# EAGLE design usbmidi (EAGLE 9.6.1)

## Sheet 1 of 2
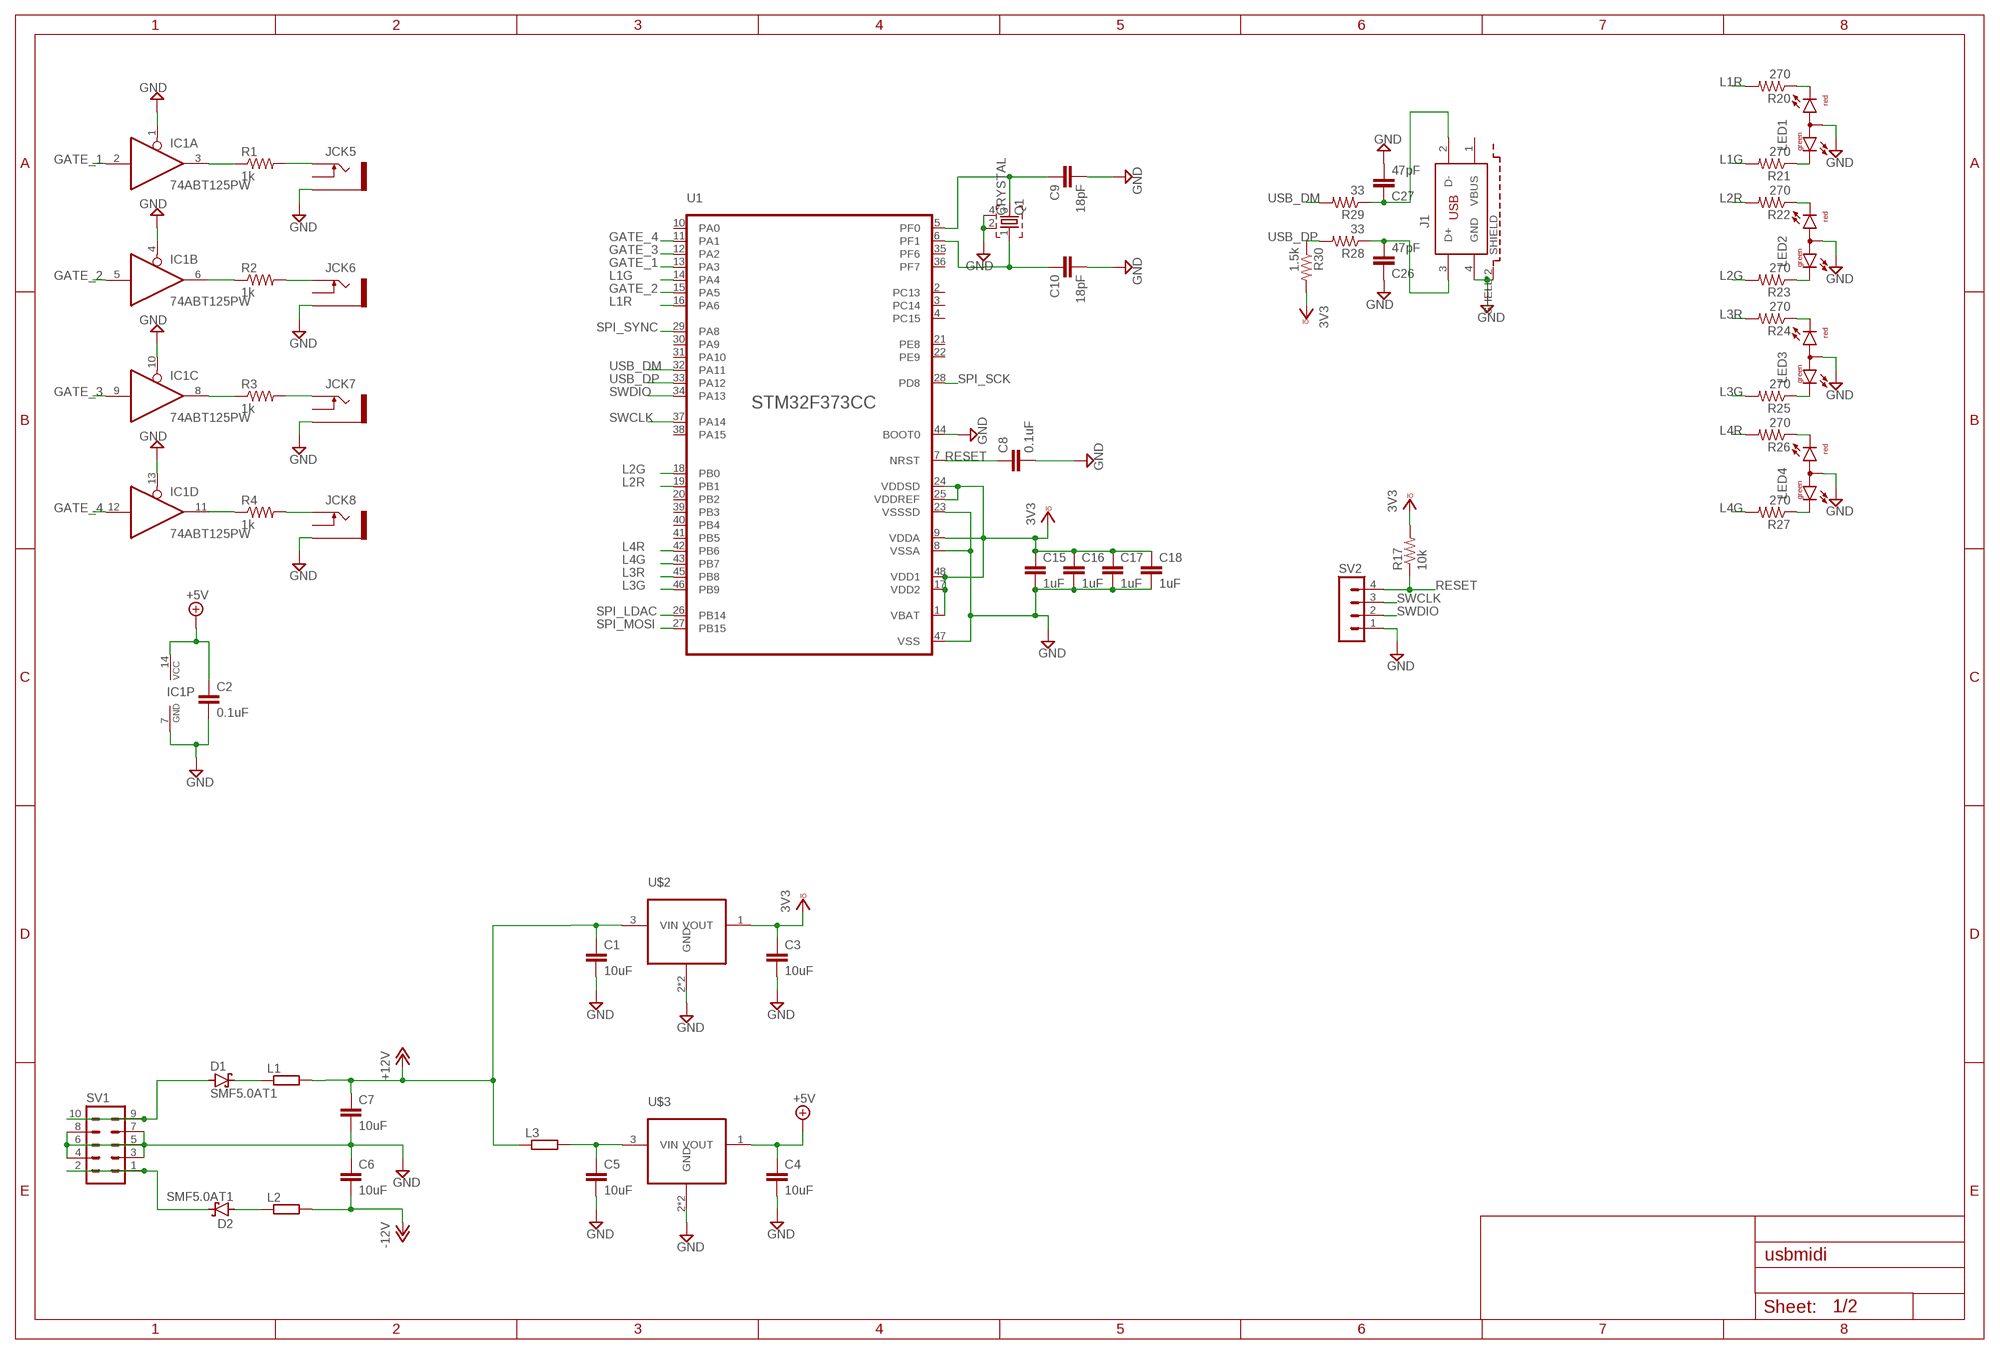
[diagram p0: schematic, sheet 1]

### Parts
C1  10uF  C-EUC0805  [C0805]
C2  0.1uF  C-EUC0603K  [C0603K]
C3  10uF  C-EUC0805  [C0805]
C4  10uF  C-EUC0805  [C0805]
C5  10uF  C-EUC0805  [C0805]
C6  10uF  C-EUC0805  [C0805]
C7  10uF  C-EUC0805  [C0805]
C8  0.1uF  C-EUC0603K  [C0603K]
C9  18pF  C-EUC0603K  [C0603K]
C10  18pF  C-EUC0603K  [C0603K]
C15  1uF  C-EUC0603K  [C0603K]
C16  1uF  C-EUC0603K  [C0603K]
C17  1uF  C-EUC0603K  [C0603K]
C18  1uF  C-EUC0603K  [C0603K]
C26  47pF  C-EUC0603K  [C0603K]
C27  47pF  C-EUC0603K  [C0603K]
D1  SMF5.0AT1  [SOD123FL]
D2  SMF5.0AT1  [SOD123FL]
IC1  74ABT125PW  [TSSOP14]
J1  61400413321  [61400413321]
JCK5  THONKICONNNEW  [WQP-PJ301M-12_JACK]
JCK6  THONKICONNNEW  [WQP-PJ301M-12_JACK]
JCK7  THONKICONNNEW  [WQP-PJ301M-12_JACK]
JCK8  THONKICONNNEW  [WQP-PJ301M-12_JACK]
L1  R-EU_R0603  [R0603]
L2  R-EU_R0603  [R0603]
L3  R-EU_R0603  [R0603]
LED1  L-115WEGW-CA  [DUOLED-A-3MM]
LED2  L-115WEGW-CA  [DUOLED-A-3MM]
LED3  L-115WEGW-CA  [DUOLED-A-3MM]
LED4  L-115WEGW-CA  [DUOLED-A-3MM]
Q1  CRYSTAL  [CTS406]
R1  1k  R-US_R0603  [R0603]
R2  1k  R-US_R0603  [R0603]
R3  1k  R-US_R0603  [R0603]
R4  1k  R-US_R0603  [R0603]
R17  10k  R-US_R0603  [R0603]
R20  270  R-US_R0603  [R0603]
R21  270  R-US_R0603  [R0603]
R22  270  R-US_R0603  [R0603]
R23  270  R-US_R0603  [R0603]
R24  270  R-US_R0603  [R0603]
R25  270  R-US_R0603  [R0603]
R26  270  R-US_R0603  [R0603]
R27  270  R-US_R0603  [R0603]
R28  33  R-US_R0603  [R0603]
R29  33  R-US_R0603  [R0603]
R30  1.5k  R-US_R0603  [R0603]
SV1  MA05-2  [MA05-2]
SV2  MA04-1  [MA04-1]
U1  STM32F373LQFP48  [LQFP48]
U$2  LD2981ABUSOT89  [SOT89]
U$3  LD2981ABUSOT89  [SOT89]

### Nets
+5V: C2.1 C4.1 IC1.14(P:VCC) U$3.1(VOUT) ; also sheet 2
+12V: C1.1 C7.1 L1.2 L3.1 U$2.3(VIN) ; also sheet 2
-12V: C6.2 L2.2 ; also sheet 2
GATE_1: IC1.2(A:I) U1.13(PA3)
GATE_2: IC1.5(B:I) U1.15(PA5)
GATE_3: IC1.9(C:I) U1.12(PA2)
GATE_4: IC1.12(D:I) U1.11(PA1)
GND: C1.2 C2.2 C3.2 C4.2 C5.2 C6.1 C7.2 C8.2 C9.2 C10.2 C15.2 C16.2 C17.2 C18.2 C26.1 C27.2 IC1.1(A:OE) IC1.4(B:OE) IC1.7(P:GND) IC1.10(C:OE) IC1.13(D:OE) J1.4(GND) J1.SHELL1(SHIELD) J1.SHELL(SHIELD) JCK5.P$3_SLEEVE(SLEEVE) JCK6.P$3_SLEEVE(SLEEVE) JCK7.P$3_SLEEVE(SLEEVE) JCK8.P$3_SLEEVE(SLEEVE) LED1.2(A) LED2.2(A) LED3.2(A) LED4.2(A) Q1.2 Q1.4 SV1.3 SV1.4 SV1.5 SV1.6 SV1.7 SV1.8 SV2.1 U1.8(VSSA) U1.23(VSSSD) U1.44(BOOT0) U1.47(VSS) U$2.2(GND) U$2.2@1(GND) U$3.2(GND) U$3.2@1(GND) ; also sheet 2
L1G: R21.2 U1.14(PA4)
L1R: R20.2 U1.16(PA6)
L2G: R23.2 U1.18(PB0)
L2R: R22.2 U1.19(PB1)
L3G: R25.2 U1.46(PB9)
L3R: R24.2 U1.45(PB8)
L4G: R27.2 U1.43(PB7)
L4R: R26.2 U1.42(PB6)
N$1: C9.1 Q1.3 U1.5(PF0)
N$2: C26.2 J1.3(D+) R28.1
N$3: C5.1 L3.2 U$3.3(VIN)
N$4: C27.1 J1.2(D-) R29.1
N$5: IC1.3(A:O) R1.1
N$6: IC1.6(B:O) R2.1
N$7: IC1.8(C:O) R3.1
N$8: IC1.11(D:O) R4.1
N$9: JCK5.P$1_TIP(TIP) R1.2
N$10: JCK6.P$1_TIP(TIP) R2.2
N$11: JCK7.P$1_TIP(TIP) R3.2
N$12: JCK8.P$1_TIP(TIP) R4.2
N$17: D1.C L1.1
N$18: D2.A L2.1
N$19: D2.C SV1.1 SV1.2
N$20: D1.A SV1.9 SV1.10
N$28: LED2.1(CG) R23.1
N$32: LED2.3(CR) R22.1
N$33: LED1.1(CG) R21.1
N$37: LED1.3(CR) R20.1
N$38: LED4.3(CR) R26.1
N$39: LED4.1(CG) R27.1
N$40: LED3.1(CG) R25.1
N$42: LED3.3(CR) R24.1
N$43: C10.1 Q1.1 U1.6(PF1)
RESET: C8.1 R17.1 SV2.4 U1.7(NRST)
SPI_LDAC: U1.26(PB14) ; also sheet 2
SPI_MOSI: U1.27(PB15) ; also sheet 2
SPI_SCK: U1.28(PD8) ; also sheet 2
SPI_SYNC: U1.29(PA8) ; also sheet 2
SWCLK: SV2.3 U1.37(PA14)
SWDIO: SV2.2 U1.34(PA13)
USB_DM: R29.2 U1.32(PA11)
USB_DP: R28.2 R30.1 U1.33(PA12)
VCCIO: C3.1 C15.1 C16.1 C17.1 C18.1 R17.2 R30.2 U1.1(VBAT) U1.9(VDDA) U1.17(VDD2) U1.24(VDDSD) U1.25(VDDREF) U1.48(VDD1) U$2.1(VOUT) ; supply symbol labelled 3V3 ; also sheet 2
Unconnected: J1.1(VBUS) JCK5.P$2_SWITCH(SWITCH) JCK6.P$2_SWITCH(SWITCH) JCK7.P$2_SWITCH(SWITCH) JCK8.P$2_SWITCH(SWITCH) U1.2(PC13) U1.3(PC14) U1.4(PC15) U1.10(PA0) U1.20(PB2) U1.21(PE8) U1.22(PE9) U1.30(PA9) U1.31(PA10) U1.35(PF6) U1.36(PF7) U1.38(PA15) U1.39(PB3) U1.40(PB4) U1.41(PB5)

## Sheet 2 of 2
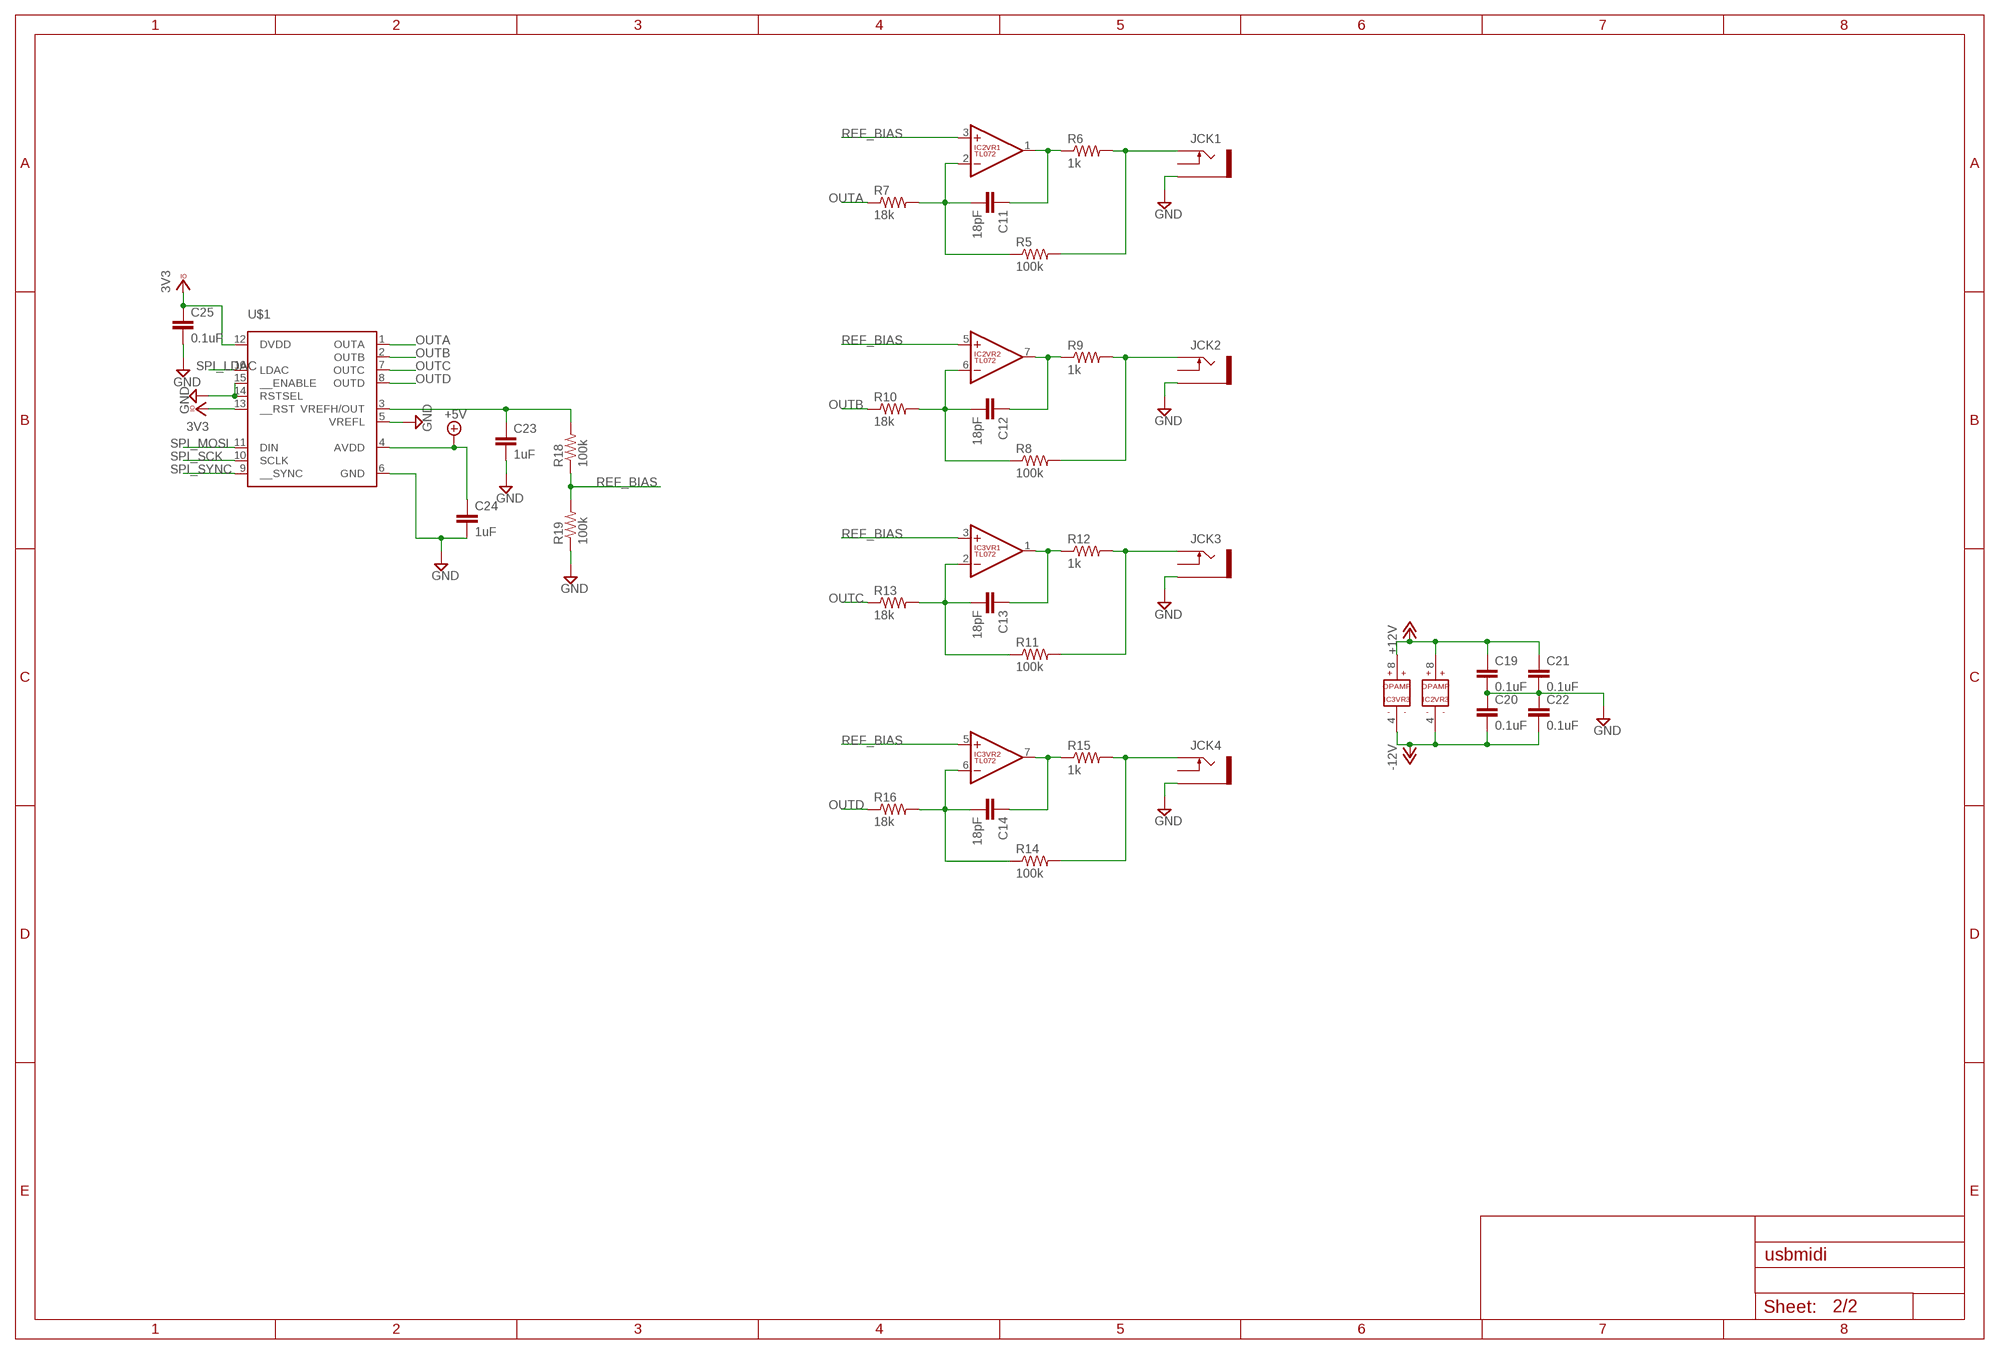
[diagram p1: schematic, sheet 2]

### Parts
C11  18pF  C-EUC0603K  [C0603K]
C12  18pF  C-EUC0603K  [C0603K]
C13  18pF  C-EUC0603K  [C0603K]
C14  18pF  C-EUC0603K  [C0603K]
C19  0.1uF  C-EUC0603K  [C0603K]
C20  0.1uF  C-EUC0603K  [C0603K]
C21  0.1uF  C-EUC0603K  [C0603K]
C22  0.1uF  C-EUC0603K  [C0603K]
C23  1uF  C-EUC0603K  [C0603K]
C24  1uF  C-EUC0603K  [C0603K]
C25  0.1uF  C-EUC0603K  [C0603K]
IC2  TL072  [SO08]
IC3  TL072  [SO08]
JCK1  THONKICONNNEW  [WQP-PJ301M-12_JACK]
JCK2  THONKICONNNEW  [WQP-PJ301M-12_JACK]
JCK3  THONKICONNNEW  [WQP-PJ301M-12_JACK]
JCK4  THONKICONNNEW  [WQP-PJ301M-12_JACK]
R5  100k  R-US_R0603  [R0603]
R6  1k  R-US_R0603  [R0603]
R7  18k  R-US_R0603  [R0603]
R8  100k  R-US_R0603  [R0603]
R9  1k  R-US_R0603  [R0603]
R10  18k  R-US_R0603  [R0603]
R11  100k  R-US_R0603  [R0603]
R12  1k  R-US_R0603  [R0603]
R13  18k  R-US_R0603  [R0603]
R14  100k  R-US_R0603  [R0603]
R15  1k  R-US_R0603  [R0603]
R16  18k  R-US_R0603  [R0603]
R18  100k  R-US_R0603  [R0603]
R19  100k  R-US_R0603  [R0603]
U$1  DAC8565  [TSSOP16]

### Nets
+5V: C24.1 U$1.4(AVDD) ; also sheet 1
+12V: C19.1 C21.1 IC2.8(VR3:V+) IC3.8(VR3:V+) ; also sheet 1
-12V: C20.2 C22.2 IC2.4(VR3:V-) IC3.4(VR3:V-) ; also sheet 1
GND: C19.2 C20.1 C21.2 C22.1 C23.2 C24.2 C25.2 JCK1.P$3_SLEEVE(SLEEVE) JCK2.P$3_SLEEVE(SLEEVE) JCK3.P$3_SLEEVE(SLEEVE) JCK4.P$3_SLEEVE(SLEEVE) R19.1 U$1.5(VREFL) U$1.6(GND) U$1.14(RSTSEL) U$1.15(__ENABLE) ; also sheet 1
N$13: C11.2 IC2.2(VR1:-IN) R5.1 R7.2
N$14: C11.1 IC2.1(VR1:OUT) R6.1
N$15: JCK1.P$1_TIP(TIP) R5.2 R6.2
N$21: C12.2 IC2.6(VR2:-IN) R8.1 R10.2
N$22: C12.1 IC2.7(VR2:OUT) R9.1
N$23: JCK2.P$1_TIP(TIP) R8.2 R9.2
N$24: C23.1 R18.2 U$1.3(VREFH/OUT)
N$25: C13.2 IC3.2(VR1:-IN) R11.1 R13.2
N$26: C13.1 IC3.1(VR1:OUT) R12.1
N$27: JCK3.P$1_TIP(TIP) R11.2 R12.2
N$29: C14.2 IC3.6(VR2:-IN) R14.1 R16.2
N$30: C14.1 IC3.7(VR2:OUT) R15.1
N$31: JCK4.P$1_TIP(TIP) R14.2 R15.2
OUTA: R7.1 U$1.1(OUTA)
OUTB: R10.1 U$1.2(OUTB)
OUTC: R13.1 U$1.7(OUTC)
OUTD: R16.1 U$1.8(OUTD)
REF_BIAS: IC2.3(VR1:+IN) IC2.5(VR2:+IN) IC3.3(VR1:+IN) IC3.5(VR2:+IN) R18.1 R19.2
SPI_LDAC: U$1.16(LDAC) ; also sheet 1
SPI_MOSI: U$1.11(DIN) ; also sheet 1
SPI_SCK: U$1.10(SCLK) ; also sheet 1
SPI_SYNC: U$1.9(__SYNC) ; also sheet 1
VCCIO: C25.1 U$1.12(DVDD) U$1.13(__RST) ; supply symbol labelled 3V3 ; also sheet 1
Unconnected: JCK1.P$2_SWITCH(SWITCH) JCK2.P$2_SWITCH(SWITCH) JCK3.P$2_SWITCH(SWITCH) JCK4.P$2_SWITCH(SWITCH)

## Library data of the parts
C1-C27 = resistor:C-EU: CAPACITOR, European symbol
D1 D2 = diode:SMF5.0AT1: 200 W Transient Voltage Suppressor Source: Data sheet <http://www.onsemi.com/pub_link/Collateral/SMF5.0AT1-D.PDF>
IC1 = 74xx-eu:74*125: Quad bus BUFFER, 3-state
IC2 IC3 = EurorackModularParts:TL072
J1 = Wurth_Elektronik_Electromechanic_Input-Output_Connectors_rev19a:61400413321: WR-COM Vertical USB Type B,4 pins=>Code : Con_I-O_COM_USB-2.0_B_61400413321 <http://katalog.we-online.de/media/images/v2/Family_S290_WR-COM_USB_TypeB_61400413321_4C.jpg> Details see: http://katalog.we-online.de/en/em/COM_TYPE_B_VERTICAL Created 2014-07-09, Karrer Zheng 2014 (C) Würth Elektronik
JCK1-JCK8 = BitFox:THONKICONN: 3.5mm socket for Eurorack modular synths
L1-L3 = resistor:R-EU_: RESISTOR, European symbol
LED1-LED4 = led:L-115WEGW-CA: T-1(3mm) BI-COLOR INDICATOR LAMP Source: Kingbright .. 2_colour_led_.pdf
Q1 = BitFox:CRYSTAL
R1-R30 = resistor:R-US_: RESISTOR, American symbol
SV1 = con-lstb:MA05-2: PIN HEADER; OC_FARNELL: unknown; OC_NEWARK: unknown
SV2 = con-lstb:MA04-1: PIN HEADER; OC_FARNELL: unknown; OC_NEWARK: unknown
U1 = BitFox:STM32F373
U$1 = BitFox:DAC8565
U$2 U$3 = BitFox:LD2981ABU

## Board
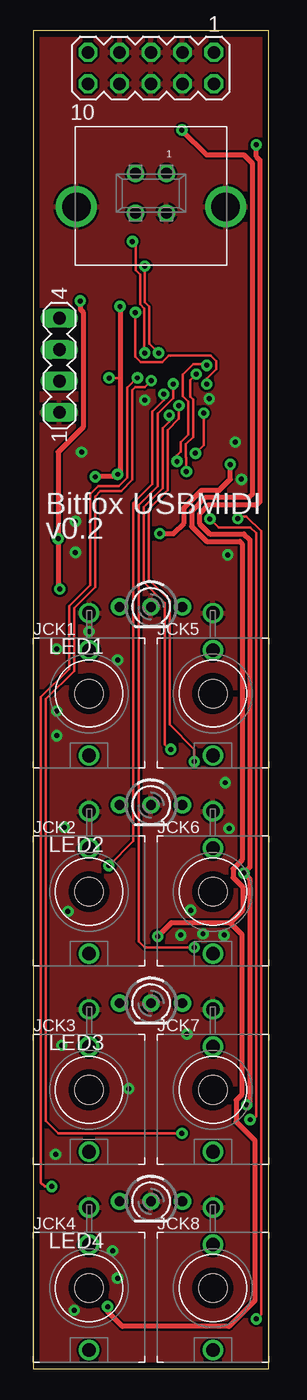
[diagram p2: board, top side]
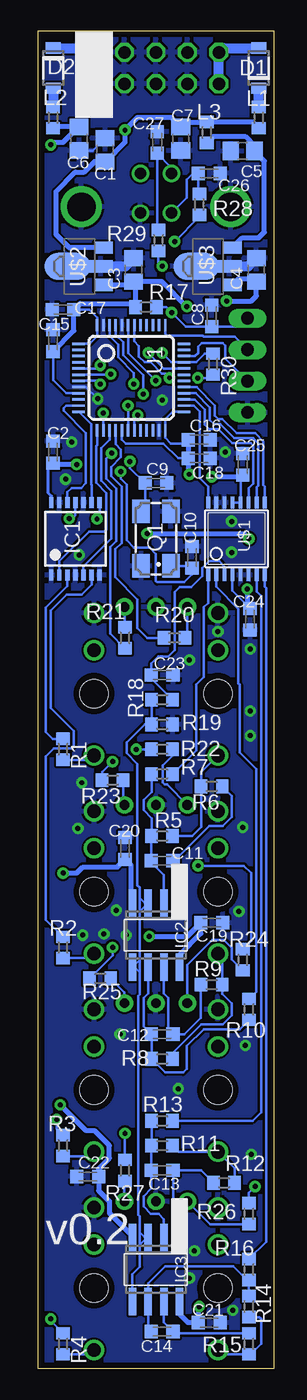
[diagram p3: board, bottom side, seen from below]

Size 19 x 108 mm. Coordinates in mm from the lower left corner, seen from the top.
Outline: 0,0 19,0 19,108 0,108 0,0
Copper layers (1*16): Top 0.035mm / dielectric 1.5mm / Bottom 0.035mm
Design rules "PCBCart-Standard *": minimum track width 7mil, minimum drill 0.4mm, track to track 7mil, track to pad 7mil, pad to pad 7mil, via to via 7mil, smd to smd 7mil, copper to edge 20mil, drill to drill 8mil, minimum pad ring 8mil, minimum via ring 10mil, stop-mask expansion 3mil, vias tented up to drill 25mil, thermal gap 8mil
bKeepout: area 2.5,101.5 to 16.5,108

### Footprints (pad centres in the part's own frame; a part is rotated, then mirrored left to right if it is on the bottom)
C0805 = smd 1.3 x 1.5: 1 -0.95,0; 2 0.95,0
C0603K = smd 1.05 x 1.08: 1 -0.875,0; 2 0.875,0
SOD123FL = smd 0.91 x 1.22: A 1.625,0; C -1.625,0
TSSOP14 = smd 0.35 x 0.9: 1 -1.95,-2.925; 2 -1.3,-2.925; 3 -0.65,-2.925; 4 0,-2.925; 5 0.65,-2.925; 6 1.3,-2.925; 7 1.95,-2.925; 8 1.95,2.925; 9 1.3,2.925; 10 0.65,2.925; 11 0,2.925; 12 -0.65,2.925; 13 -1.3,2.925; 14 -1.95,2.925
SO08 = smd 0.6 x 2.2: 1 -1.905,-2.6; 2 -0.635,-2.6; 3 0.635,-2.6; 4 1.905,-2.6; 5 1.905,2.6; 6 0.635,2.6; 7 -0.635,2.6; 8 -1.905,2.6
61400413321 = drill 0.92: 1 1.25,0; 2 -1.25,0; 3 -1.25,-3.2; 4 1.25,-3.2 | drill 2.3: SHELL -6.02,-2.7; SHELL1 6.02,-2.7
WQP-PJ301M-12_JACK = drill 1.1: P$1_TIP 0,5; P$2_SWITCH 0,-3.5; P$3_SLEEVE 0,-6.5 | hole 2.286: 0,0
R0603 = smd 1 x 1.1: 1 -0.85,0; 2 0.85,0
DUOLED-A-3MM = drill 0.8 pad 1.4: 1 -2.54,0; 2 0,0; 3 2.54,0
CTS406 = smd 1.9 x 1.4: 1 -2.2,-1.2; 2 2.2,-1.2; 3 2.2,1.2; 4 -2.2,1.2
MA05-2 = drill 1.016 octagon: 1 -5.08,-1.27; 2 -5.08,1.27; 3 -2.54,-1.27; 4 -2.54,1.27; 5 0,-1.27; 6 0,1.27; 7 2.54,-1.27; 8 2.54,1.27; 9 5.08,-1.27; 10 5.08,1.27
MA04-1 = drill 1.016 long: 1 -3.81,0; 2 -1.27,0; 3 1.27,0; 4 3.81,0
LQFP48 = smd 1 x 0.2: 1 -4.25,2.75; 2 -4.25,2.25; 3 -4.25,1.75; 4 -4.25,1.25; 5 -4.25,0.75; 6 -4.25,0.25; 7 -4.25,-0.25; 8 -4.25,-0.75; 9 -4.25,-1.25; 10 -4.25,-1.75; 11 -4.25,-2.25; 12 -4.25,-2.75; 25 4.25,-2.75; 26 4.25,-2.25; 27 4.25,-1.75; 28 4.25,-1.25; 29 4.25,-0.75; 30 4.25,-0.25; 31 4.25,0.25; 32 4.25,0.75; 33 4.25,1.25; 34 4.25,1.75; 35 4.25,2.25; 36 4.25,2.75 | smd 0.2 x 1: 13 -2.75,-4.25; 14 -2.25,-4.25; 15 -1.75,-4.25; 16 -1.25,-4.25; 17 -0.75,-4.25; 18 -0.25,-4.25; 19 0.25,-4.25; 20 0.75,-4.25; 21 1.25,-4.25; 22 1.75,-4.25; 23 2.25,-4.25; 24 2.75,-4.25; 37 2.75,4.25; 38 2.25,4.25; 39 1.75,4.25; 40 1.25,4.25; 41 0.75,4.25; 42 0.25,4.25; 43 -0.25,4.25; 44 -0.75,4.25; 45 -1.25,4.25; 46 -1.75,4.25; 47 -2.25,4.25; 48 -2.75,4.25
TSSOP16 = smd 0.305 x 0.991: 1 -2.275,-2.918; 2 -1.625,-2.918; 3 -0.975,-2.918; 4 -0.325,-2.918; 5 0.325,-2.918; 6 0.975,-2.918; 7 1.625,-2.918; 8 2.275,-2.918; 9 2.275,2.918; 10 1.625,2.918; 11 0.975,2.918; 12 0.325,2.918; 13 -0.325,2.918; 14 -0.975,2.918; 15 -1.625,2.918; 16 -2.275,2.918
SOT89 = smd 1 x 1.5: 1 -1.499,-1.981; 3 1.499,-1.981 | smd 1 x 2: 2 0,-1.727 | smd 2.2 x 3.7: 2@1 0,0.94

### Placement (x,y rotation side)
C1  13.6,98.4 90 bottom
C2  17.8,74 90 bottom
C3  11.3,88.7 90 bottom
C4  1.4,88.7 90 bottom
C5  2.5,98.3 180 bottom
C6  15.7,99.3 90 bottom
C7  7.5,99.3 270 bottom
C8  5,85 90 bottom
C9  9.5,71.5 0 bottom
C10  6.6,65.5 90 bottom
C11  9,41 180 bottom
C12  9,27 180 bottom
C13  9,16 180 bottom
C14  9,3 180 bottom
C15  17.8,83 90 bottom
C16  6,75 0 bottom
C17  17,85.5 180 bottom
C18  6,73.5 0 bottom
C19  5,36 0 bottom
C20  12,42 270 bottom
C21  5.2,3.7 0 bottom
C22  15,15.5 0 bottom
C23  9,56 0 bottom
C24  1.9,60.5 270 bottom
C25  2.5,73 90 bottom
C26  5.2,96.5 180 bottom
C27  9.4,99 90 bottom
D1  1.2,105 90 bottom
D2  17.8,105 270 bottom
IC1  16,67 0 bottom
IC2  9.5,35 180 bottom
IC3  9.5,8 180 bottom
J1  9.5,96.5 0 top
JCK1  4.5,54.5 180 top
JCK2  4.5,38.5 180 top
JCK3  4.5,22.5 180 top
JCK4  4.5,6.5 180 top
JCK5  14.5,54.5 180 top
JCK6  14.5,38.5 180 top
JCK7  14.5,22.5 180 top
JCK8  14.5,6.5 180 top
L1  1.2,101 270 bottom
L2  17.8,101 270 bottom
L3  5.4,99.8 270 bottom
LED1  9.5,61.5 180 top
LED2  9.5,45.5 180 top
LED3  9.5,29.5 180 top
LED4  9.5,13.5 180 top
Q1  9.5,67 90 bottom
R1  17,50 270 bottom
R2  17,34 270 bottom
R3  17,18 270 bottom
R4  17,2 270 bottom
R5  9,43 0 bottom
R6  5,47 180 bottom
R7  9,48 180 bottom
R8  9,25 0 bottom
R9  5,31 0 bottom
R10  2,29 270 bottom
R11  9,18 0 bottom
R12  4,15 0 bottom
R13  9,20 180 bottom
R14  2,5 270 bottom
R15  2,2 270 bottom
R16  2,8 270 bottom
R17  10.3,85.7 180 bottom
R18  9,54 0 bottom
R19  9,52 180 bottom
R20  8,59 180 bottom
R21  12,59 270 bottom
R22  9,50 180 bottom
R23  13,47.5 180 bottom
R24  2.5,33 90 bottom
R25  14,31.5 180 bottom
R26  2,12.5 90 bottom
R27  12,16 90 bottom
R28  6,94 270 bottom
R29  9.3,91.1 270 bottom
R30  4.9,81.1 270 bottom
SV1  9.5,105 180 top
SV2  2.1,81 90 top
U1  11.5,80 0 bottom
U$1  3,67 0 bottom
U$2  15.7,89 90 bottom
U$3  5.3,89 90 bottom

### Tracks (layer width: path | path; a pad name or v marks a point on that pad's centre or on a via)
+5V  (via drill 0.4)
  Top 0.406: v3.8,86.2 3.8,85.52 4.03,85.29 4.03,76.03 2,74 v2,67 2,63.06 v2.13,62.93 | v15.91,73 15.91,71.81 15.02,70.92 13.6,70.92 12.18,69.5 12.18,68.28 11.31,67.41 v10.22,67.41
  Bottom 0.203: C24.1 3.33,62.8 U$1.4
  Bottom 0.254: IC1.14 17.95,70.45 18.2,70.7 18.2,72.72 C2.1
  Bottom 0.406: v2.13,62.93 2.13,61.61 C24.1 | v15.91,73 17.68,73 C2.1 | v3.8,86.2 1.8,86.2 1.4,86.6 C4.1 1.65,88 2.82,88 U$3.1 | v10.22,67.41 2.41,67.41 v2,67
+12V  (via drill 0.4)
  Top 0.406: v6,5 6,4.6 7.2,3.4 15.8,3.4 17.88,5.48 17.88,18.42 16.36,19.93 16.36,21.66 16.87,22.16 16.87,35.02 15.89,36 | 15.89,36 16.89,37 16.89,38.89 16.14,39.64 16.14,40.36 16.87,41.08 16.87,66.6 16.68,66.78 14,66.78 12.79,67.99 12.79,69.25 13.85,70.31 17.41,70.31 17.68,70.58 17.68,97.32 17,98 14,98 v12,100 | v10.04,34.9 11.14,36 15.89,36
  Bottom 0.406: v10.04,34.9 6.97,34.9 C19.1 5.88,35.12 7.59,33.41 IC2.8 | IC3.8 7.59,4.39 6.9,3.7 C21.1 6.08,4.92 v6,5 | U$2.3 16.5,90.5 17.56,91.56 17.56,95.04 16,96.6 15.3,96.6 14.45,97.45 C1.1 13.55,97.45 12,99 v12,100 11,101 8.25,101 C7.1 7.1,100.65 L3.1 1.7,100.65 L1.2
-12V  (via drill 0.4)
  Top 0.406: v17.23,21.3 17.48,21.55 17.48,39.52 v17,40 17.48,40.48 17.48,66.92 17.01,67.39 14.25,67.39 13.4,68.24 13.4,69 14.1,69.7 17.99,69.7 18.29,70 18.29,97.57 18,97.86 v18,98.8
  Bottom 0.406: v17,40 15.9,40 15.4,40.5 12.62,40.5 C20.2 11.51,40.63 11.51,37.7 IC2.4 | v17.23,21.3 15.12,19.2 14.46,19.2 13.27,18.01 13.27,16.99 14.12,16.13 C22.2 14.12,14.37 13.27,13.51 13.27,12.57 11.4,10.71 IC3.4 | C6.2 16,100.25 | 16,100.25 17.7,100.25 L2.2 | v18,98.8 17.8,99 17,99 16,100 16,100.25
GATE_1
  Bottom 0.203: IC1.2 17.3,65.2 14.9,67.6 13.6,67.6 13.5,67.7 13.5,70.7 14.34,71.54 14.34,74.48 14.25,74.57 U1.13
GATE_2
  Bottom 0.203: U1.15 13.25,74.99 13.93,74.31 13.93,71.7 13.09,70.87 13.09,67 13.1,67 15.35,64.75 IC1.5
GATE_3
  Bottom 0.203: U1.12 14.74,76.24 14.74,71.37 14.7,71.33 IC1.9
GATE_4
  Bottom 0.203: U1.11 16.75,77.75 16.95,77.55 16.95,77.36 15.15,75.55 15.15,71.5 15.55,71.1 16.3,71.1 16.65,70.75 IC1.12
GND  (via drill 0.4)
  Bottom 0.203: v14.2,78.3 15.15,79.25 U1.8 | C6.1 14.6,98.35 C1.2
  Bottom 0.813: U$2.2 11.95,89 C3.2 | U$3.2 2.05,89 C4.2
  other vias: 3.9,74 1.9,58.1 9,78.2 2.5,43.7 2.3,26.1 7.7,22.6 1.8,17.3 6.4,9.5 6.8,7.3 16.3,74.8 16.8,71.8 15.7,65.7 3.3,4.7 1.9,53.1 1.9,51.1 3.4,68.4 3.4,65.9 2.8,36.9 15.5,47.3 12.4,27 4.5,59.5 6.8,57.2 15.4,35 12.7,37 13.7,35.1 15.8,43.6 11.9,35
  pour Bottom: 19,108 19,0 0,0 0,108
  pour Top: 19,108 19,0 0,0 0,108
L1G  (via drill 0.4)
  Top 0.203: v13.09,73.9 13.75,74.57 v13.75,77.15
  Bottom 0.203: R21.2 13.2,59.35 13.2,66.32 12.69,66.83 12.69,71.04 13.52,71.87 13.52,73.46 v13.09,73.9 | v13.75,77.15 U1.14
L1R
  Bottom 0.203: U1.16 12.75,74.64 12.33,74.22 12.33,73.59 13.12,72.8 13.12,72.04 12.28,71.2 12.28,66.66 12.79,66.15 12.79,63.89 11,62.1 11,59.8 10.2,59 R20.2
L2G  (via drill 0.4)
  Top 0.203: v13,49 13,50 11,52 11,62 9.31,63.69 9.31,69.38 10.84,70.92 10.84,75.77 11.76,76.68 v11.76,77.76
  Bottom 0.203: v13,49 13.85,48.15 R23.2 | U1.18 v11.75,77.75 v11.76,77.76
L2R  (via drill 0.4)
  Top 0.203: v10.97,76.97 10.97,76.47 10.44,75.94 10.44,71.08 8.9,69.55 8.9,63.52 10.59,61.83 10.59,50.41 11,50 v11.1,50
  Bottom 0.203: U1.19 11.25,76.69 v10.97,76.97 | v11.1,50 R22.2
L3G  (via drill 0.4)
  Top 0.203: v11.29,79.5 11.29,78.36 10.03,77.1 10.03,71.25 8.49,69.72 8.49,46 8.5,45.99 8.5,45.92 8.49,45.92 8.49,34.51 9,34 v13,34
  Bottom 0.203: U1.46 13.25,83.38 12.56,82.69 12.56,81.65 11.29,80.38 v11.29,79.5 | R25.2 13,33.35 v13,34
L3R  (via drill 0.4)
  Top 0.203: v10.53,78.68 10.53,78.18 9.62,77.27 9.62,71.42 8.09,69.89 8.09,42.59 v6.1,40.6
  Bottom 0.203: U1.45 12.75,83.45 12.16,82.86 12.16,81.82 10.53,80.2 v10.53,78.68 | R24.2 1.8,34.55 1.8,40 2.4,40.6 v6.1,40.6
L4G  (via drill 0.4)
  Top 0.203: v9.52,79.76 8.99,79.23 8.22,79.23 8.01,79.02 8.01,71.76 7.08,70.83 5.41,70.83 5,70.42 5,63.1 3.3,61.4 3.3,56.33 1.02,54.04 1.02,20 2.02,19 v12,19
  Bottom 0.203: U1.43 11.75,81.99 v9.52,79.76 | R27.2 v12,19
L4R  (via drill 0.4)
  Top 0.203: v8.41,79.99 7.6,79.18 7.6,71.93 6.91,71.24 5.24,71.24 4.59,70.59 4.59,63.27 2.89,61.57 2.89,56.49 0.61,54.21 0.61,15 0.91,14.7 v1.5,14.7
  Bottom 0.203: U1.42 11.25,82.95 10.87,82.57 10.87,81.69 10.43,81.24 9.93,81.24 9.03,80.34 8.76,80.34 v8.41,79.99 | v1.5,14.7 2,14.2 R26.2
N$1  (via drill 0.4)
  Top 0.203: v11.6,73.24 11.6,73.7 11.92,74.02 11.92,74.82 12.52,75.42 12.52,78.07 12.05,78.54 12.05,80.25 12.9,81.1 13.91,81.1 v14,81.01
  Bottom 0.203: U1.5 14.26,80.75 v14,81.01 | Q1.3 10.38,69.53 C9.1 11.6,72.72 v11.6,73.24
N$2
  Bottom 0.203: J1.3 7,94.55 7,96 6.5,96.5 C26.2 6.08,94.92 R28.1
N$3
  Bottom 0.406: U$3.3 2.52,91.3 1.2,91.3 0.75,91.75 0.75,97.5 C5.1 1.55,98.75 2.3,99.5 4.85,99.5 L3.2
N$4
  Bottom 0.203: J1.2 8.25,96.97 C27.1 9.4,92.05 R29.1
N$5
  Bottom 0.203: IC1.3 16.65,63.17 18.39,61.43 18.39,51.39 17.85,50.85 R1.1
N$6
  Bottom 0.203: IC1.6 14.7,63.3 15.5,62.5 16.7,62.5 17.98,61.22 17.98,53.31 16.14,51.48 16.14,50.22 16.32,50.05 17.75,50.05 18.39,49.4 18.39,36.24 R2.1
N$7  (via drill 0.4)
  Top 0.203: v14.26,68.6 14.96,67.9 16,67.9 17.52,67.9 17.98,67.44 17.98,20.35 17.73,20.1 v17.5,20.1
  Bottom 0.203: IC1.8 14.05,68.81 v14.26,68.6 | v17.5,20.1 17.5,19.35 R3.1
N$8  (via drill 0.4)
  Top 0.203: v18,4 18.39,4.39 18.39,67.61 17.2,68.8 16.67,68.8 v16.5,68.63
  Bottom 0.203: IC1.11 16,68.9 16.27,68.63 v16.5,68.63 | v18,4 18,3.85 R4.1
N$9
  Bottom 0.203: R1.2 14.85,49.15 JCK5.P$1_TIP
N$10
  Bottom 0.203: R2.2 14.85,33.15 JCK6.P$1_TIP
N$11
  Bottom 0.203: R3.2 14.85,17.15 JCK7.P$1_TIP
N$12
  Bottom 0.203: R4.2 14.85,1.15 JCK8.P$1_TIP
N$13
  Bottom 0.203: IC2.2 8.87,39.87 9.88,40.88 C11.2 9.88,42.98 R5.1 9.85,44.43 10.51,45.08 10.51,45.92 9.85,46.57 R7.2
N$14
  Bottom 0.203: C11.1 8.06,40.94 | 8.06,40.94 7.59,40.47 IC2.1 | R6.1 3.37,46.22 3.37,44.53 4.1,43.8 5.2,43.8 8.06,40.94
N$15
  Bottom 0.203: JCK1.P$1_TIP 5.85,48.15 R6.2 5.85,43.73 6.58,43 R5.2
N$17
  Bottom 0.813: L1.1 D1.C
N$18
  Bottom 0.813: D2.A L2.1
N$19
  Bottom 0.813: D2.C 14.94,106.62 SV1.1 SV1.2
N$20
  Bottom 0.813: D1.A 4.07,106.62 SV1.9 SV1.10
N$21
  Bottom 0.203: IC2.6 10.13,30.29 10.51,29.92 10.51,27.63 C12.2 9.85,26.98 R8.1 8.75,23.9 7.3,23.9 7,24.2 7,26.05 5.66,27.39 4,27.39 3.63,27.39 2.76,27.39 R10.2
N$22
  Bottom 0.203: IC2.7 8.87,30.29 8.49,29.92 8.49,27.37 C12.1 7.2,27 5.9,28.3 5.9,30.95 R9.1
N$23
  Bottom 0.203: R8.2 8.15,25.48 5.83,27.8 5,27.8 4.1,27.8 3.37,28.53 3.37,29.47 4.15,30.25 R9.2 4.15,33.15 JCK2.P$1_TIP
N$24
  Bottom 0.203: R18.2 9.88,55.73 C23.1 9.88,56.92 9.3,57.5 8.5,57.5 8,58 8,62.7 7.58,63.12 6.65,63.12 5.78,63.98 5.78,64.62 5.2,65.2 4.4,65.2 3.98,64.78 U$1.3
N$25
  Bottom 0.203: IC3.2 8.87,12.06 9.29,12.49 9.92,12.49 10.51,13.08 10.51,13.92 9.88,14.55 C13.2 9.88,17.98 R11.1 R13.2
N$26
  Bottom 0.203: IC3.1 7.59,11.6 8.12,12.12 C13.1 5.85,16 R12.1
N$27
  Bottom 0.203: R12.2 3.15,16.15 JCK3.P$1_TIP 7.65,17.5 R11.2
N$28
  Bottom 0.203: R23.1 12.15,45.61 LED2.1
N$29
  Bottom 0.203: C14.2 10.13,3.26 IC3.6 10.13,6.87 8.75,8.25 3.25,8.25 2,7 | R14.1 2,7 | 2,7 R16.2
N$30
  Bottom 0.203: IC3.7 8.87,3.74 C14.1 7.97,2.85 R15.1
N$31
  Bottom 0.203: JCK4.P$1_TIP 4.15,1.15 R15.2 1.85,1.15 1,2 1,4 1.15,4.15 R14.2
N$32
  Bottom 0.203: R22.1 8.15,49.48 8.96,48.68 8.96,47.32 8.78,47.15 8.61,47.15 LED2.3
N$33
  Bottom 0.203: R21.1 12,61.46 LED1.1
N$37
  Bottom 0.203: R20.1 6.96,59.19 LED1.3
N$38
  Bottom 0.203: LED4.3 5.11,11.65 R26.1
N$39
  Bottom 0.203: R27.1 12.04,15.11 LED4.1
N$40
  Bottom 0.203: R25.1 12.04,30.39 LED3.1
N$42
  Bottom 0.203: R24.1 3.4,33.05 3.4,33.96 4.04,34.6 4.96,34.6 6.96,32.6 LED3.3
N$43  (via drill 0.4)
  Top 0.203: v12.36,72.43 12.36,73.56 12.33,73.59 12.33,74.63 12.92,75.22 12.92,78.24 12.68,78.48 12.68,79.81 v13.15,80.28
  Bottom 0.203: v12.36,72.43 12.36,71.86 11.87,71.37 11.87,66.87 11.3,66.3 10.02,66.3 9.5,65.78 9.5,63.6 9.4,63.5 7.2,63.5 6.6,64.1 C10.1 6.78,64.8 Q1.1 | U1.6 13.19,80.25 v13.15,80.28
OUTA
  Bottom 0.203: U$1.1 5.28,61.82 5.63,61.47 5.63,55.85 6.25,55.23 6.25,49.9 R7.1
OUTB
  Bottom 0.203: R10.1 1.42,30.43 1.42,48.42 2.75,49.75 2.75,55.23 2.85,55.32 2.85,61.34 4.62,63.12 U$1.2
OUTC
  Bottom 0.203: U$1.7 1.38,62.75 1.02,62.39 1.02,20.68 1.7,20 R13.1
OUTD
  Bottom 0.203: U$1.8 0.72,63.12 0.61,63.01 0.61,63 0.61,10.24 R16.1
REF_BIAS
  Bottom 0.203: R18.1 R19.2 10,52 10.4,52 11.86,50.54 11.86,49.69 11,48.83 11,39.03 10.8,38.83 10.8,38 | 10.8,38 10.8,37 | 10.8,37 10.8,33 | 10.8,33 10.8,32 | 10.8,32 10.8,30.2 10.91,30.09 10.91,12.4 10.8,12.29 10.8,11 | IC3.5 11.4,7.59 10.8,8.2 10.8,10 | 10.8,10 10.8,11 | 10.8,10 10.2,10.6 IC3.3 10.4,10.6 10.8,11 | 10.8,38 10.4,37.6 IC2.3 10.73,37 10.8,37 | 10.8,33 IC2.5 11.2,32.4 10.8,32
RESET  (via drill 0.4)
  Top 0.203: v14,79.49 14,79.94 14.76,80.69 14.76,81.32 14.31,81.77 10.95,81.77 10.43,81.24 8.69,81.24 8.24,81.69 v8.24,85.27
  Bottom 0.203: SV2.4 2.79,84.12 C8.1 7.1,84.12 v8.24,85.27 8.67,85.7 R17.1 | U1.7 14.26,79.75 v14,79.49
SPI_LDAC
  Bottom 0.203: U$1.16 5.28,71.2 5.96,71.88 5.96,77.25 6.45,77.75 U1.26
SPI_MOSI
  Bottom 0.203: U$1.11 2.02,71.1 1.66,71.47 1.66,74.53 1.83,74.7 3.33,74.7 4.47,75.84 5.19,75.84 5.55,76.2 5.55,77.42 6.38,78.25 U1.27
SPI_SCK
  Bottom 0.203: U$1.10 1.38,71.18 1.25,71.31 1.25,74.69 1.67,75.11 3.17,75.11 4.3,76.25 4.8,76.25 5.14,76.59 5.14,77.59 6.3,78.75 U1.28
SPI_SYNC
  Bottom 0.203: U$1.9 0.72,71.22 0.84,71.34 0.84,74.86 1.5,75.52 3,75.52 4.14,76.66 4.46,76.66 4.74,76.94 4.74,77.76 6.23,79.25 U1.29
SWCLK
  Bottom 0.203: U1.37 8.75,83.55 8.6,83.4 5.74,83.4 5.66,83.32 3.15,83.32 SV2.3
SWDIO
  Bottom 0.203: SV2.2 3.9,81.53 3.9,82.6 4.1,82.8 5.8,82.8 6.1,82.5 6.1,82 6.35,81.75 U1.34
USB_DM  (via drill 0.4)
  Top 0.203: v10.11,82 9.36,82.76 9.36,85.73 9,86.09 v9,89
  Bottom 0.203: v10.11,82 8.86,80.75 U1.32 | R29.2 9.3,89.3 v9,89
USB_DP  (via drill 0.4)
  Top 0.203: v9,82 8.97,82.03 8.97,85.57 8.62,85.93 8.62,88.34 8.27,88.7 8.27,90.73 v8,91
  Bottom 0.203: v9,82 8.25,81.25 U1.33 6.25,81.25 5.55,81.95 R30.1 | v8,91 6,93 R28.2
VCCIO  (via drill 0.4)
  Top 0.203: 7,80 6.98,79.98 v6.12,79.98
  Top 0.406: v7,85.76 7,80 7,72.4 v6.8,72.2 6.6,72 v5,72
  Bottom 0.203: U1.1 14.85,82.75 14.25,83.35 U1.48 14.25,84.85 14.9,85.5 C17.1 | U1.25 8.15,77.25 8.75,76.65 U1.24 8.75,75.15 8.3,74.7 7.17,74.7 C16.1 | U$1.13 U$1.12 2.67,71.95 C25.1 | U1.17 12.25,75 11.95,74.7 8.9,74.7 7.7,73.5 C18.1 | U1.9 16.75,78.75 17.8,79.8 C15.1 | v6.12,79.98 5.17,79.98 R30.2
  Bottom 0.406: C15.1 16.12,83.8 C17.1 15.62,86 11.15,86 | C16.1 C18.1 6.88,72.28 v6.8,72.2 | v5,72 2.62,72 C25.1 | U$2.1 11.55,87.5 C3.1 | R17.2 11.15,86 | 11.15,86 11.15,87.6 C3.1 | v7,85.76 8.99,87.75 C3.1

### Text on the board
tPlace: Bitfox USBMIDI | v0.2
bPlace: v0.2